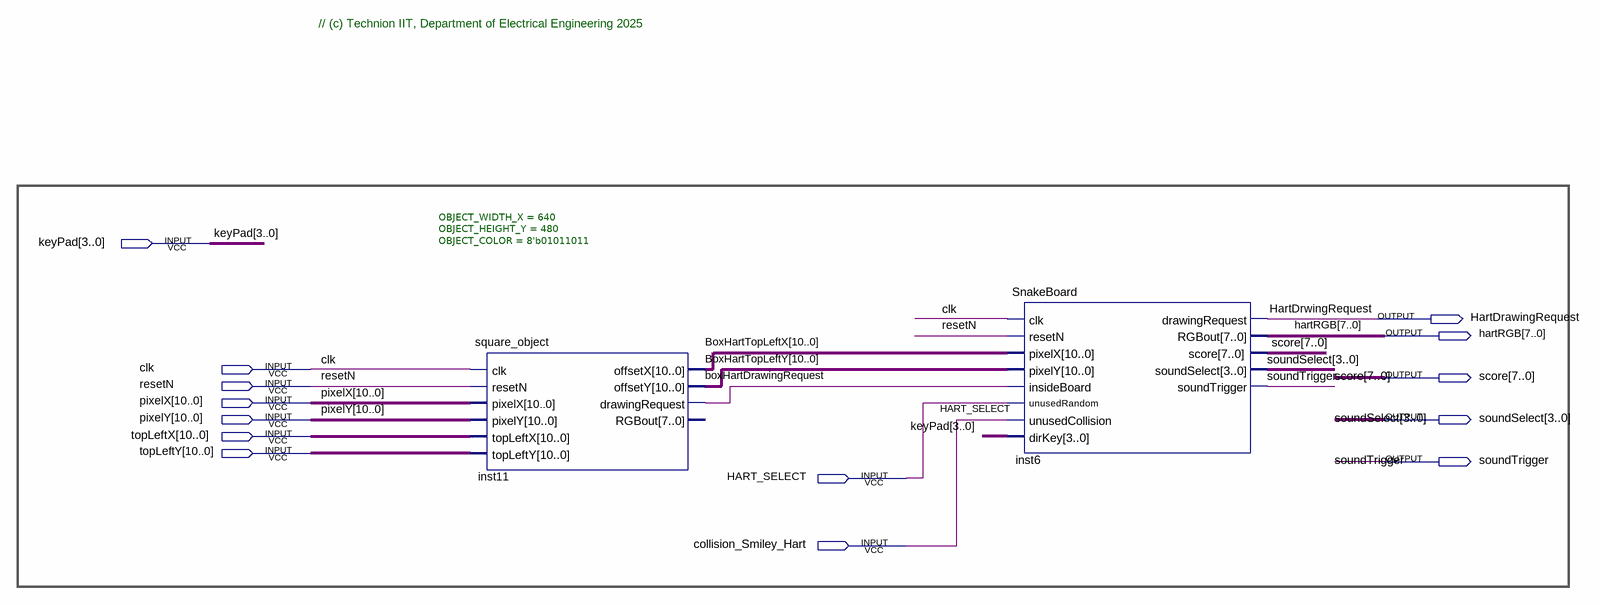
[diagram p0: schematic sheet]
// Quartus schematic SnakeDisplay.bdf as structural Verilog: 2 symbols, 14 pins
module SnakeDisplay (
  input  [3:0] keyPad,
  input  clk,
  input  resetN,
  input  [10:0] pixelX,
  input  [10:0] pixelY,
  input  [10:0] topLeftX,
  input  [10:0] topLeftY,
  input  HART_SELECT,
  input  collision_Smiley_Hart,
  output HartDrawingRequest,
  output [7:0] hartRGB,
  output [7:0] score,
  output [3:0] soundSelect,
  output soundTrigger
);

  wire boxHartDrawingRequest;
  wire [10:0] BoxHartTopLeftX, BoxHartTopLeftY;

  square_object #(.OBJECT_WIDTH_X(640), .OBJECT_HEIGHT_Y(480), .OBJECT_COLOR(8'b01011011)) inst11 (
    .clk(clk), .resetN(resetN), .pixelX(pixelX), .pixelY(pixelY), .topLeftX(topLeftX), .topLeftY(topLeftY),
    .offsetX(BoxHartTopLeftX), .offsetY(BoxHartTopLeftY), .drawingRequest(boxHartDrawingRequest));  // open: RGBout
  SnakeBoard inst6 (
    .clk(clk), .resetN(resetN), .pixelX(BoxHartTopLeftX), .pixelY(BoxHartTopLeftY),
    .insideBoard(boxHartDrawingRequest), .unusedRandom(HART_SELECT), .unusedCollision(collision_Smiley_Hart),
    .dirKey(keyPad), .drawingRequest(HartDrawingRequest), .RGBout(hartRGB), .score(score),
    .soundSelect(soundSelect), .soundTrigger(soundTrigger));

  // Other names for the same wires on the sheet: HartDrwingRequest = HartDrawingRequest

  // Notes on the sheet:
  //   // (c) Technion IIT, Department of Electrical Engineering 2025
endmodule
